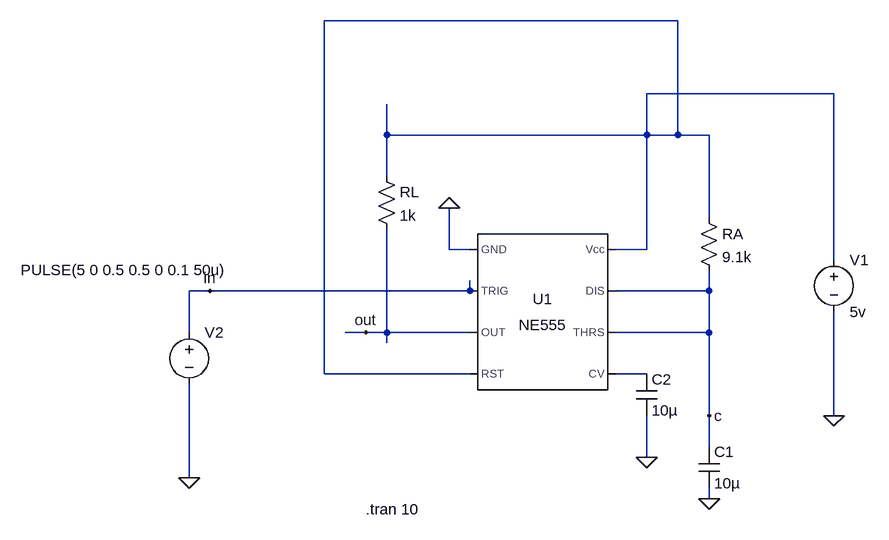
[diagram p0: schematic Timer555ForMonostableOperation.asc]
Timer555ForMonostableOperation.asc, the LTspice schematic file:
Version 4
SHEET 1 880 680
WIRE 576 -160 32 -160
WIRE 816 -48 528 -48
WIRE 128 16 128 -32
WIRE 528 16 528 -48
WIRE 528 16 128 16
WIRE 576 16 576 -160
WIRE 576 16 528 16
WIRE 624 16 576 16
WIRE 128 80 128 16
WIRE 624 144 624 16
WIRE 224 192 224 128
WIRE 256 192 224 192
WIRE 528 192 528 16
WIRE 528 192 480 192
WIRE 816 208 816 -48
WIRE -144 256 -176 256
WIRE 256 256 256 240
WIRE 256 256 -144 256
WIRE 624 256 624 224
WIRE 624 256 480 256
WIRE -176 320 -176 256
WIRE 96 320 64 320
WIRE 128 320 128 160
WIRE 128 320 96 320
WIRE 256 320 128 320
WIRE 624 320 624 256
WIRE 624 320 480 320
WIRE 128 336 128 320
WIRE 32 384 32 -160
WIRE 256 384 32 384
WIRE 528 384 480 384
WIRE 624 448 624 320
WIRE 816 448 816 288
WIRE 624 496 624 448
WIRE 528 512 528 448
WIRE -176 544 -176 400
WIRE 624 576 624 560
FLAG 624 576 0
FLAG 528 512 0
FLAG 224 128 0
FLAG 816 448 0
FLAG -176 544 0
FLAG -144 256 in
FLAG 96 320 out
FLAG 624 448 c
SYMBOL NE555 368 288 R0
SYMATTR InstName U1
SYMBOL res 112 64 R0
SYMATTR InstName RL
SYMATTR Value 1k
SYMBOL res 608 128 R0
SYMATTR InstName RA
SYMATTR Value 9.1k
SYMBOL cap 608 496 R0
SYMATTR InstName C1
SYMATTR Value 10µ
SYMBOL cap 512 384 R0
SYMATTR InstName C2
SYMATTR Value 10µ
SYMBOL voltage 816 192 R0
SYMATTR InstName V1
SYMATTR Value 5v
SYMBOL voltage -176 304 R0
WINDOW 3 -259 -80 Left 2
SYMATTR Value PULSE(5 0 0.5 0.5 0 0.1 50u)
SYMATTR InstName V2
TEXT 96 592 Left 2 !.tran 10

The netlist it stands for:
* Timer555ForMonostableOperation.asc
XU1 0 in out N001 N002 c c N001 NE555  ; pins GND TRIG OUT RST CV THRS DIS Vcc
RL N001 out 1k
RA N001 c 9.1k
C1 c 0 10µ
C2 N002 0 10µ
V1 N001 0 5v
V2 in 0 PULSE(5 0 0.5 0.5 0 0.1 50u)
.tran 10
.lib NE555.sub
.backanno
.end